# Altium schematic sheet Buck-Boost_1.SchDoc
size A4; SheetNumber: 7; SheetTotal: 10
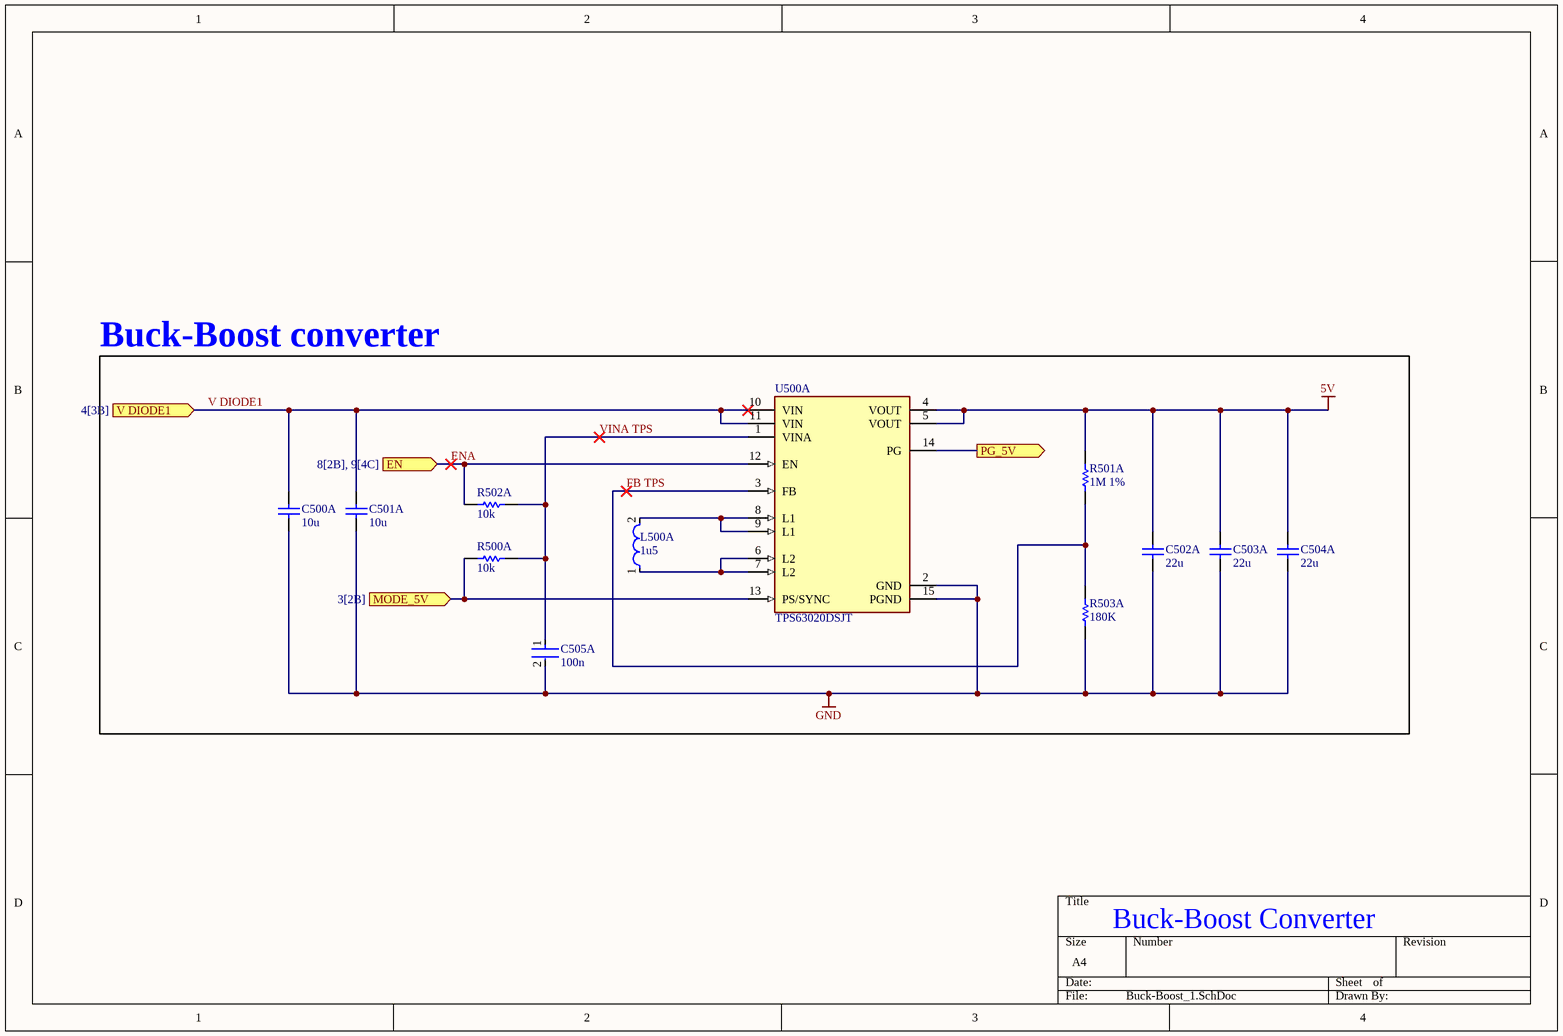
[diagram p0: Buck-Boost_1.SchDoc]

## Parts
C500A  10u  [CAPC3216X180X50LL20T25]
C501A  10u  [CAPC3216X180X50LL20T25]
C502A  22u  [CAPC1206(3216)190_L]
C503A  22u  [CAPC1206(3216)190_L]
C504A  22u  [CAPC1206(3216)190_L]
C505A  100n  [FP-CGA3E-0_3-0_1-IPC_A]
L500A  1u5  [FP-DFE252010C-IPC_A]
R500A  10k  [RESC2013X60X35NL10T20]
R501A  1M 1%  [RESC1608X55X25LL10T15]
R502A  10k  [RESC2013X60X35NL10T20]
R503A  180K  [RESC1005X40X25NL05T10]
U500A  TPS63020DSJT  [FP-DSJ0014A-MFG]

## Blocks framed on the sheet
Buck-Boost converter: C500A C501A C502A C503A C504A C505A L500A R500A R501A R502A R503A U500A

## Ports
EN (in, see 8[2B], 9[4C]), MODE_5V (in, see 3[2B]), PG_5V (out, see 3[2B]), V DIODE1 (in, see 4[3B])

## Nets
5V: C502A.2 C503A.2 C504A.2 R501A.2 U500A.4(VOUT) U500A.5(VOUT)
GND: C500A.1 C501A.1 C502A.1 C503A.1 C504A.1 C505A.2 R503A.1 U500A.2(GND) U500A.15(PGND)
ENA: R502A.1 U500A.12(EN) ; port EN
FB TPS: R501A.1 R503A.2 U500A.3(FB)
MODE_5V: R500A.1 U500A.13(PS/SYNC) ; port MODE_5V
PG_5V: U500A.14(PG) ; port PG_5V
V DIODE1: C500A.2 C501A.2 U500A.10(VIN) U500A.11(VIN) ; port V DIODE1
VINA TPS: C505A.1 R500A.2 R502A.2 U500A.1(VINA)
NetL500A_1: L500A.1 U500A.6(L2) U500A.7(L2)
NetL500A_2: L500A.2 U500A.8(L1) U500A.9(L1)

## Notes on the sheet
- Buck-Boost Converter

## Library data of the parts
C500A C501A = CMP-2000-06013-1: Chip Capacitor, 10 uF, +/- 10%, 10 V, -55 to 125 degC, 1206 (3216 Metric), RoHS, Tape and Reel; Type: SMDMLCCX7R6.3-250VDCCommericalGrade; Class: Class1; Case Height: 1.6mm; Temperature Coefficient / Code: +/-15%; Capacitance: 10uF; Brand: Kemet; Case Length: 3.2mm; Dissipation Factor DF: 5; Voltage Rating: 10V; Dielectric: X7R; Tolerance: 10%; Package Reference: 1206; Dimensions: 1.6mmWx3.2mmLx1.6mmH; Series: C1206C; Minimum Operating Temperature: -55C; RoHS: Details; Termination Style: SMD/SMT; Mounting Technology: SurfaceMount; Manufacturer: Kemet; Product Category: MultilayerCeramicCapacitorsMLCC-SMD/SMT; Case Code - mm: 3216; Manufacturer URL: http://www.kemet.com/; Product: GeneralTypeMLCCs; Package Description: 2-Pin Surface Mount Device, Body 3.2 x 1.6 mm; Case Width: 1.6mm; Factory Pack Quantity: 2000; Package / Case: 1206(3216metric); Datasheet URL: http://www.kemet.com/docfinder?Partnumber=C1206C106K8RACTU; Datasheet Version: 02/2016; Operating Temperature Range: -55Cto+125C; Voltage Rating DC: 10V; Case Code - in: 1206; Maximum Operating Temperature: +125C; Packaging: Reel
C502A C503A C504A = CMP-1037-04986-1: CAP 22uF 6.3V ±20% 1206 (3216 Metric) Thickness 1.9mm SMD; Case-EIA: 1206; Tolerance: Â±20%; Case-Metric: 3216; Value: 22uF; Max Thickness: 1.9 mm; Rated Voltage: 6.3 V; Technology: SMT
C505A = CMP-2000-07546-2: Cap Ceramic 100nF 50V X7R 10% Pad SMD 0603 +125°C Automotive T/R; Weight: 7.1E-05oz; Composition: Ceramic; Max Operating Temperature: 125°C; Termination: SMD/SMT; Dielectric: X7R; Length: 1.6mm; Package Quantity: 1; REACH SVHC: No SVHC; Lead Free: Lead Free; Case Code (Metric): 1608; Min Operating Temperature: -55°C; Packaging: Tape and Reel; Tolerance: 10%; Voltage Rating: 50V; Case Code (Imperial): 0603; Capacitance: 100nF; Case/Package: 0603; Voltage Rating (DC): 50V; Depth: 0.8mm; Radiation Hardening: No; Ratings: AEC-Q200; Mount: Surface Mount; Voltage: 50V; Thickness: 0.035inch; Width: 0.8mm; Height: 0.8mm
L500A = CMP-06042-006286-1: Shielded Wirewound Inductor 1.5uH  2500mA 0.072Ω 1008 (2520); Current Rating: 2.5A; DC Resistance (DCR): 72mR; Core Material: Ferrite; Test Frequency: 1MHz; Saturation Current: 3.8A; Tolerance: 20%; Width: 0.079inch; Case Code (Metric): 2520; Case/Package: 1008; Height - Seated (Max): 0.039inch; Min Operating Temperature: -40°C; Inductance: 1.5uH; Case Code (Imperial): 1008; Shielding: Shielded; Mount: Surface Mount; Length: 0.098inch; Packaging: Tape and Reel; Max Operating Temperature: 125°C
R500A R502A = CMP-1659-00013-4: Chip Resistor, 10 KOhm, +/- 1%, 0.125 W, -55 to 155 degC, 0805 (2012 Metric), RoHS, Tape and Reel; Manufacturer: Yageo; Voltage Rating: 150 V; Mount: Surface Mount; ComponentLink1Description: Manufacturer URL; ComponentLink2URL: http://www.yageo.com/documents/recent/PYu-RC_Group_51_RoHS_L_04.pdf; Pins: 2; Length: 2 mm; Min Operating Temperature: -55 degC; Height: 0.5 mm; Mounting Technology: Surface Mount; RoHSCompliant: true; REACH SVHC: No SVHC; ComponentLink1URL: http://www.yageo.com/; Max Operating Temperature: 155 degC; PackageReference: 0805; DatasheetVersion: Rev. 4, 02/2016; Package Quantity: 5000; Packaging: Tape and Reel; ComponentLink2Description: Datasheet; PackageDescription: 2-Pin Surface Mounted Device, Body 2 x 1.25 mm
R501A = CMP-1659-00056-1: Chip Resistor, 1 MOhm, +/- 1%, 100 mW, -55 to 155 degC, 0603 (1608 Metric), RoHS, Tape and Reel; Voltage Rating (DC): 25 V; Tolerance: 20%; Case\Package: Radial; Capacitance: 1 mF; Min Operating Temperature: -40 degC; PackageDescription: 2-Pin Surface Mount Device, Body 1.6 x 0.8 mm; ComponentLink1Description: Manufacturer URL; Radiation Hardening: No; DatasheetVersion: Rev. 4, 02/2016; REACH SVHC: No SVHC; Length: 20 mm; Max Operating Temperature: 85 degC; Diameter: 10 mm; Packaging: Bulk; Package Quantity: 200; PackageReference: 0603; Mount: Through Hole; ComponentLink1URL: http://www.yageo.com/; ComponentLink2URL: http://www.yageo.com/documents/recent/PYu-RC_Group_51_RoHS_L_04.pdf; ComponentLink2Description: Datasheet; Width: 0 inch; Lead Pitch: 5 mm; RoHSCompliant: true; Voltage Rating: 25 V; Height: 20 mm
R503A = CMP-1011-00763-4: Chip Resistor, 180 KOhm, +/- 1%, 62.5 mW, -55 to 155 degC, 0402 (1005 Metric), RoHS, Tape and Reel; Manufacturer: Basic Passives; PartNumber: RC0402FR-07180KL; Power Rating: 62.5 mW; Voltage Rating: 50 V; Case\/Package: 0402; Length: 1 mm; RoHSCompliant: true; Mounting Technology: Surface Mount; Min Operating Temperature: -55 degC; PackageDescription: 2-Pin Surface Mount Device, Body 1 x 0.5 mm; Case Code (Imperial): 0402; Resistance: 180 KOhm; ComponentLink2URL: http://download.siliconexpert.com/pdfs/2016/1/13/0/45/27/830/yageo_/manual/8727809758379137pyu-rc_group_51_rohs_l___3.pdf; Packaging: Tape and Reel; Tolerance: 1%; Width: 0.5 mm; PackageReference: 0402; Max Operating Temperature: 155 degC; Package Quantity: 200; Height: 0.35 mm; Mount: Surface Mount; Pins: 2; DatasheetVersion: 12/2015; ComponentLink1URL: http://www.yageo.com/; ComponentLink1Description: Manufacturer URL; Case Code (Metric): 1005; REACH SVHC: No SVHC; ComponentLink2Description: Datasheet
U500A = CMP-2000-07282-2: IC REG BCK BST ADJ 3.5A 14VSON; Manufacturer: Texas Instruments; Switching Frequency: 2400kHz; Output Voltage: 1.2-5.5V; Nominal Supply Current: 25uA; Standoff Height: 0mm; Switching Topology: Buck-Boost; Min Supply Voltage: 1.8V; Output Type: AdjustableProgrammable; Max Junction Temp: +125°C; Number Of Outputs: 1; Output Current: 3A; Max Supply Voltage: 5.5V; ComponentLink2URL: https://www.ti.com/lit/ds/symlink/tps63020.pdf; Ambient Temperature Range High: +85°C; Digikey Description: IC REG BCK BST ADJ 3.5A 14VSON; Ambient Temperature Range Low: -40°C; Manufacturer Part Number: TPS63020DSJT; Automotive: No; Package: DSJ0014A; Category: IC; Temperature Range High: +85°C; Temperature: -40°C to +85°C; Octopart: https://octopart.com/tps63020dsjt-texas+instruments-12976119; Temperature Range Low: -40°C; Device Class L3: Voltage Regulators - Switching; Device Class L2: Power Management ICs; RoHS: TRUE; Lead Free: Yes; Height: 1mm; Device Class L1: Integrated Circuits (ICs); Mouser Description: Voltage Regulators - Switching Regulators 93% Eff Buck-Boost Converter; ComponentLink2Description: Datasheet